# Altium schematic sheet piec.SchDoc
size A4
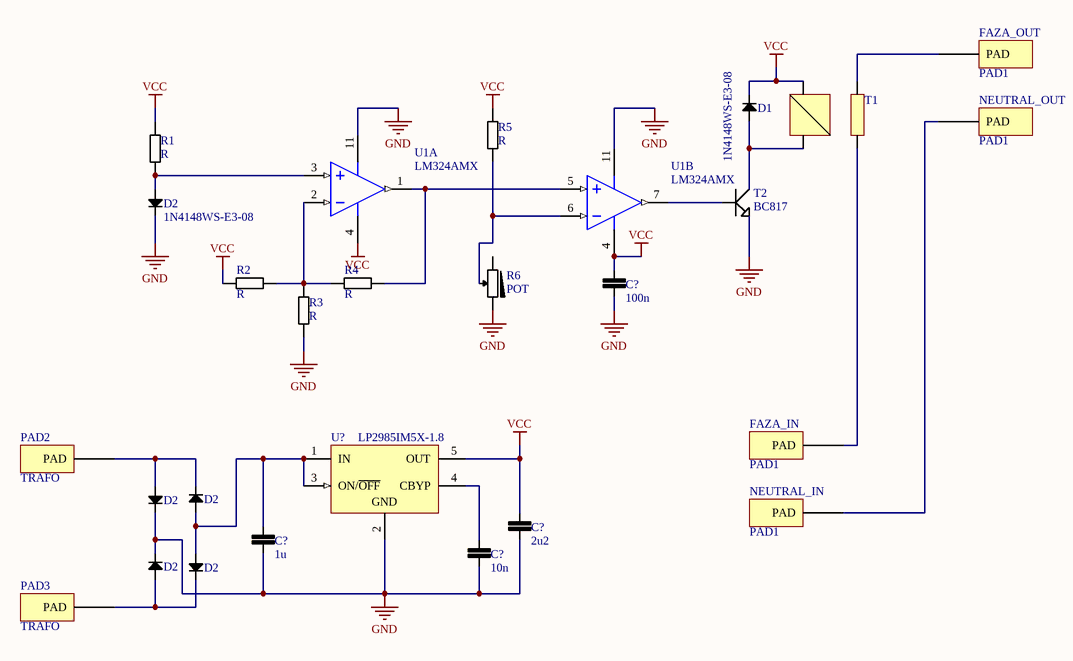
[diagram p0: piec.SchDoc]

## Parts
(Parts that share a designator on the sheet are numbered #1, #2 ... from top to bottom, then left to right.)
C?#1  100n  [1206]
C?#2  2u2  [1206]
C?#3  1u  [1206]
C?#4  10n  [1206]
D1  1N4148WS-E3-08  [SOD323]
D2#1  1N4148WS-E3-08  [SOD323]
D2#2  1N4148WS-E3-08  [SOD323]  (value not drawn)
D2#3  1N4148WS-E3-08  [SOD323]  (value not drawn)
D2#4  1N4148WS-E3-08  [SOD323]  (value not drawn)
D2#5  1N4148WS-E3-08  [SOD323]  (value not drawn)
FAZA_IN  PAD1  [PIN1_1.27x2.54]
FAZA_OUT  PAD1  [PIN1_1.27x2.54]
NEUTRAL_IN  PAD1  [PIN1_1.27x2.54]
NEUTRAL_OUT  PAD1  [PIN1_1.27x2.54]
PAD2  TRAFO  [PIN1_1.27x2.54]
PAD3  TRAFO  [PIN1_1.27x2.54]
R1  R  [0805R]
R2  R  [0805R]
R3  R  [0805R]
R4  R  [0805R]
R5  R  [0805R]
R6  POT  [Trimmer_SMD_35]
T1  transmitter  (value not drawn)
T2  BC817  [SOT23-3]
U1  LM324AMX  [M14A_M]  (parts A,B of 4)
U?  LP2985IM5X-1.8  [MF05A_M]

## Nets
GND: C?#1.2 C?#2.2 C?#3.2 C?#4.2 D2#1.1(K) D2#2.1(K) D2#4.1(K) R3.2 R6.3 T2.2(E) U1.11(GND) U?.2(GND)
VCC: C?#1.1 C?#2.1 D1.1(K) R1.1 R2.2 R5.2 T1.1(S) U1.4(V+) U?.5(OUT)
NetC?#3_1: C?#3.1 D2#3.2(A) D2#5.2(A) U?.1(IN) U?.3(ON/~{OFF})
NetC?#4_1: C?#4.1 U?.4(CBYP)
NetD1_2: D1.2(A) T1.2(S) T2.3(C)
NetD2#1_2: D2#1.2(A) R1.2 U1.3(IN1+)
NetD2#2_2: D2#2.2(A) D2#3.1(K) PAD2.1(PAD)
NetD2#4_2: D2#4.2(A) D2#5.1(K) PAD3.1(PAD)
NetFAZA_IN_1: FAZA_IN.1(PAD) T1.COM
NetFAZA_OUT_1: FAZA_OUT.1(PAD) T1.NO
NetNEUTRAL_IN_1: NEUTRAL_IN.1(PAD) NEUTRAL_OUT.1(PAD)
NetR2_1: R2.1 R3.1 R4.1 U1.2(IN1-)
NetR4_2: R4.2 U1.1(OUT1) U1.5(IN2+)
NetR5_1: R5.1 R6.2 U1.6(IN2-)
NetT2_1: T2.1(B) U1.7(OUT2)

Not connected (* = marked no-connect by the designer): R6 1

## Library data of the parts
C?#1-C?#4 = C: Kondensator; Type: Kondensator
D1 D2#1-D2#5 = 1N4148WS-E3-08: Manufacturer 1: Vishay Semiconductors; Type: Dioda; Supplier 1: Farnell; Manufacturer Part Number 1: 1N4148WS-E3-08; Supplier Part Number 1: 2164233
PAD2 PAD3 = PAD1
R1-R5 = R: Rezystor; Type: Rezystor
R6 = POT: Potencjometr montażowy; Type: Rezystor
T2 = BC817: Type: Tranzystor; Supplier 1: Farnell; Supplier Part Number 1: 1081223
U1 = CMP-0055-00740-2: Low Power Quad Operational Amplifier, 14-pin Narrow SOIC; Manufacturer: National Semiconductor; CompType: Amplifiers; PowerWise: N; PackageTopMarking: NSUZXYTTE#*LM324AM; ComponentLink2Description: LM324 Web Page; ComponentLink2URL: http://www.national.com/pf/LM/LM324.html; RevisionNote: Component URLs added; PackageDescription: Molded Package S.O., .150in Wide, 14 Lead; Code_IPC: SOIC127P600-14; ComponentLink1Description: LM324 Datasheet; ComponentLink3Description: M14A Package Page; ComponentLink1URL: http://www.national.com/ds/LM/LM324.pdf; Code_JEDEC: MS-012AB; ComponentLink3URL: http://www.national.com/packaging/folders/m14a.html; DatasheetVersion: Aug-2000; PackageVersion: revJ, Jan-1996; PackageReference: M14A; RoHS: N; PinCount: 14
U? = CMP-0062-02004-2: Micropower 150 mA Low-Noise Low-Dropout Regulator for Applications with Output Voltages â‰¤2.0V, 5-pin SOT-23; Manufacturer: National Semiconductor; PackageTopMarking: LAYB*XTT; PowerWise: N; CompType: LDO IC; ComponentLink3Description: MF05A Package Page; RoHS: N; ComponentLink1Description: LP2985 Datasheet; PinCount: 5; PackageVersion: revD, Aug-2008; RevisionNote: Component URLs added; ComponentLink2URL: http://www.national.com/pf/LP/LP2985.html; ComponentLink3URL: http://www.national.com/packaging/folders/mf05a.html; PackageDescription: Molded SOT-23, .115 x .063 x .040 in Body, 5 Lead, .0375 in Pitch; ComponentLink2Description: LP2985 Web Page; DatasheetVersion: Jun-2004; PackageReference: MF05A; ComponentLink1URL: http://www.national.com/ds/LP/LP2985LV.pdf